# Altium schematic sheet OSCILLAR_HFB_V1p0_MOD.SchDoc
size A3; SheetNumber: 8; SheetTotal: 15; Title_: Modulator
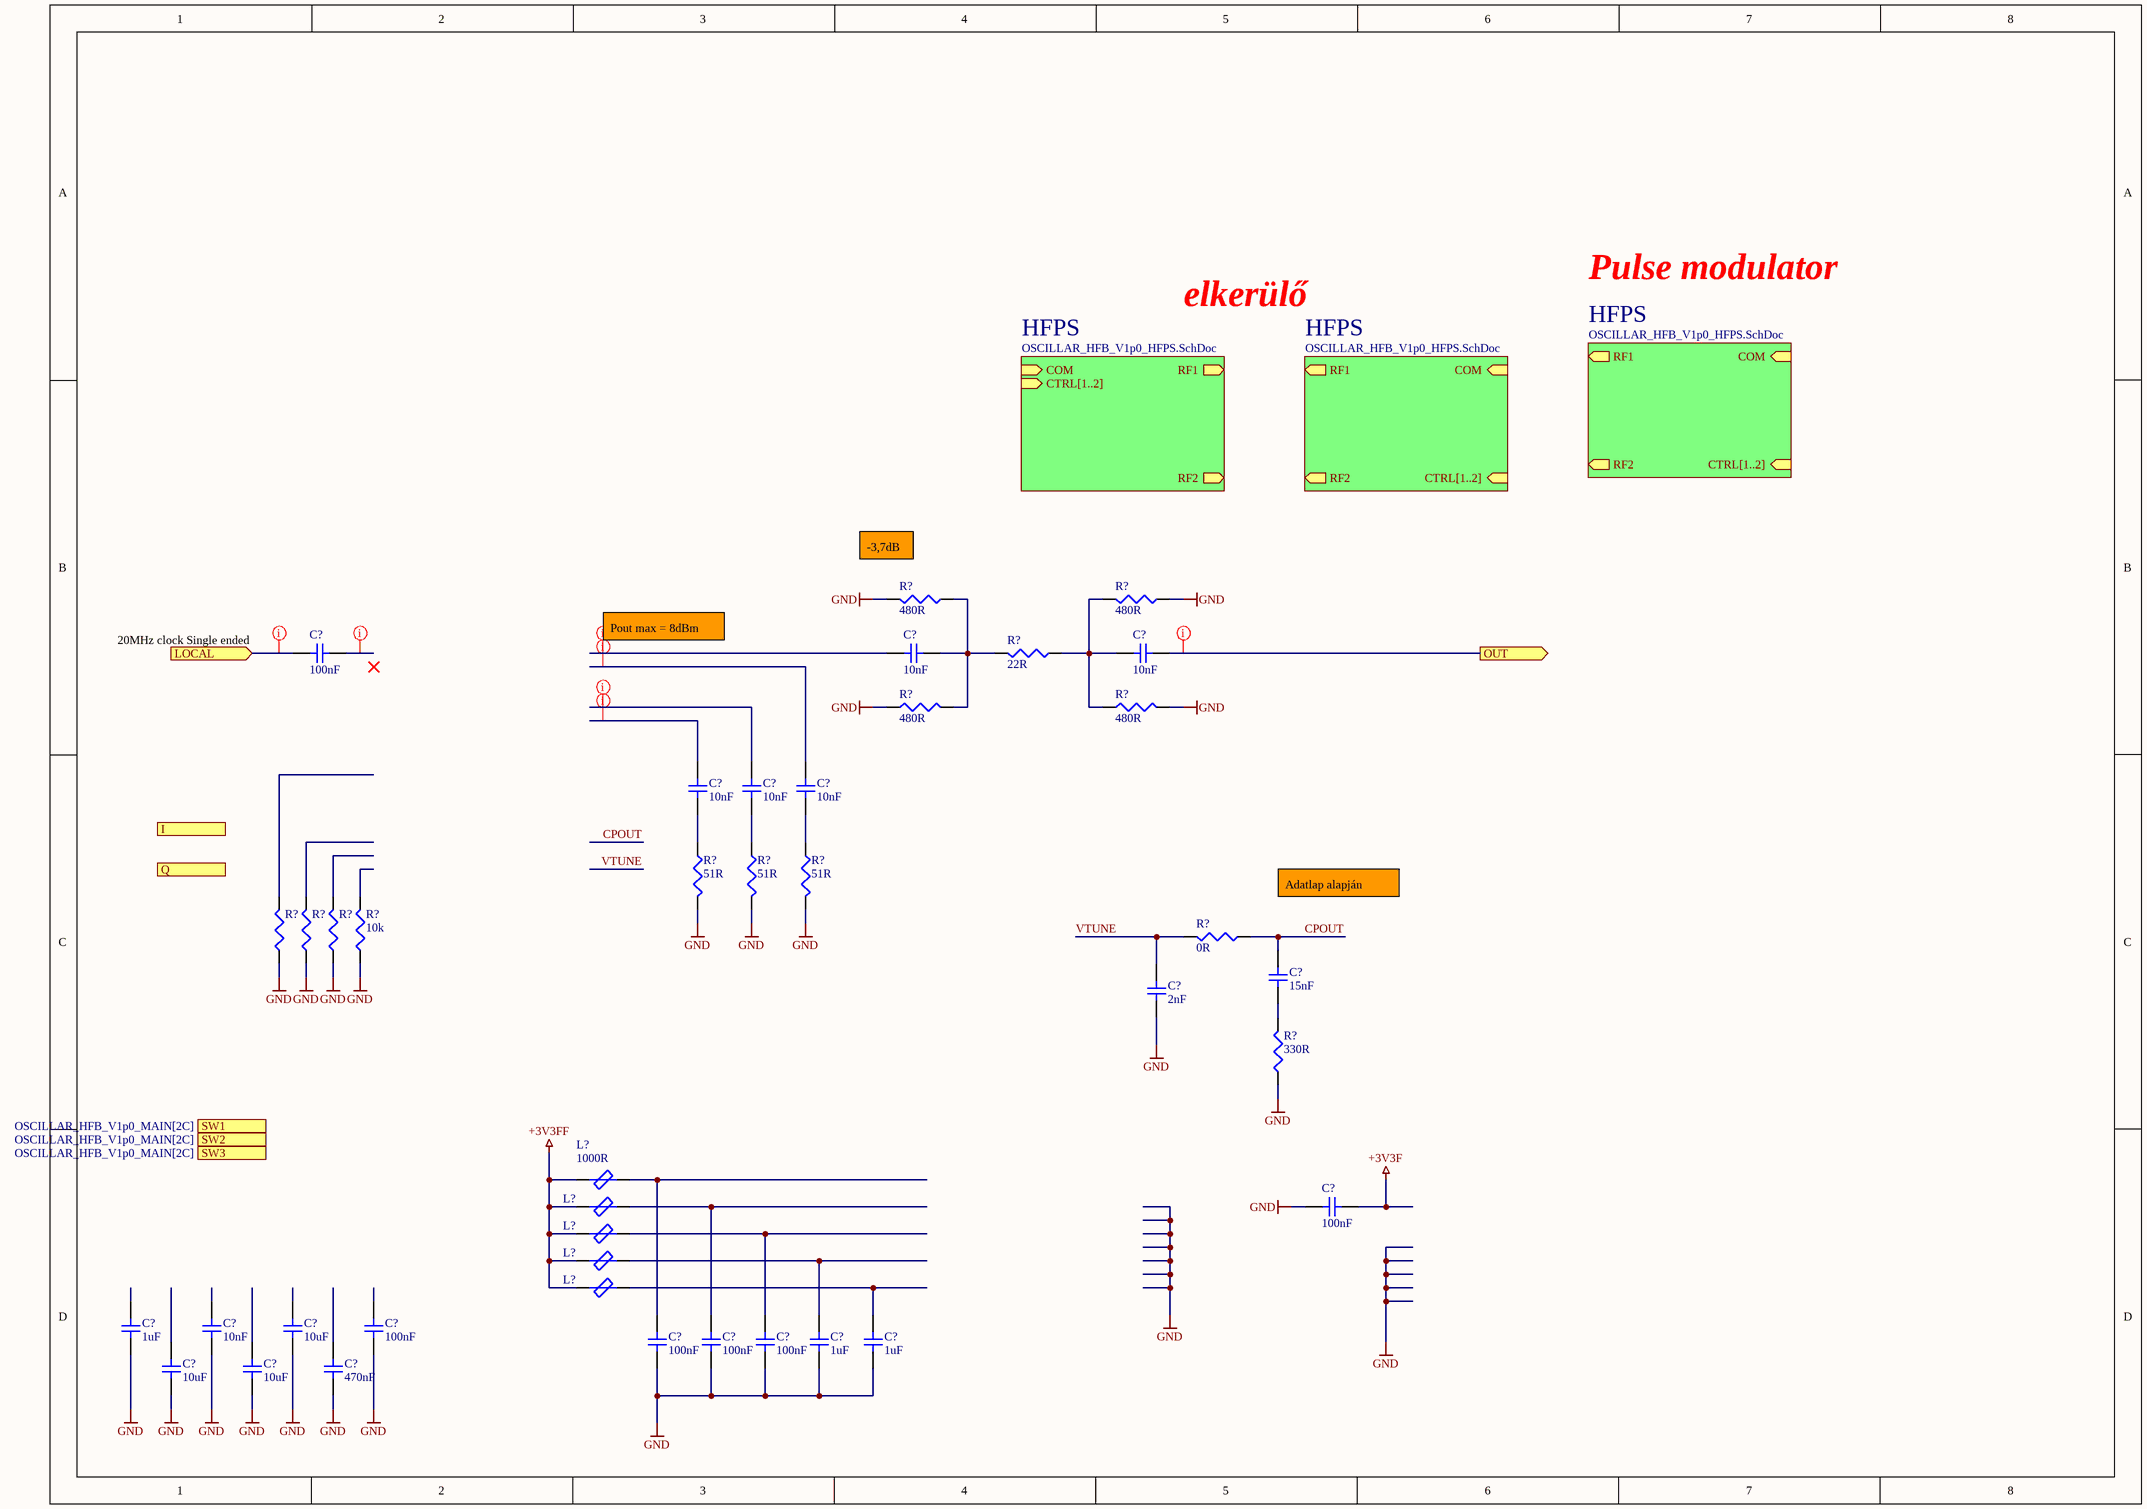
[diagram p0: OSCILLAR_HFB_V1p0_MOD.SchDoc]

## Parts
(Parts that share a designator on the sheet are numbered #1, #2 ... from top to bottom, then left to right.)
C?#1  100nF  [CAP_0603]
C?#2  10nF  [CAP_0603]
C?#3  10nF  [CAP_0603]
C?#4  10nF  [CAP_0603]
C?#5  10nF  [CAP_0603]
C?#6  10nF  [CAP_0603]
C?#7  15nF  [CAP_0603]
C?#8  2nF  [CAP_0603]
C?#9  100nF  [CAP_0603]
C?#10  1uF  [CAP_0603]
C?#11  10nF  [CAP_0603]
C?#12  10uF  [CAP_0603]
C?#13  100nF  [CAP_0603]
C?#14  100nF  [CAP_0603]
C?#15  100nF  [CAP_0603]
C?#16  100nF  [CAP_0603]
C?#17  1uF  [CAP_0603]
C?#18  1uF  [CAP_0603]
C?#19  10uF  [CAP_0603]
C?#20  10uF  [CAP_0603]
C?#21  470nF  [CAP_0603]
L?#1  1000R  [IND-0805-EMI]
L?#2  1000R  [IND-0805-EMI]  (value not drawn)
L?#3  1000R  [IND-0805-EMI]  (value not drawn)
L?#4  1000R  [IND-0805-EMI]  (value not drawn)
L?#5  1000R  [IND-0805-EMI]  (value not drawn)
R?#1  480R  [RES-0603]
R?#2  480R  [RES-0603]
R?#3  22R  [RES-0805]
R?#4  480R  [RES-0603]
R?#5  480R  [RES-0603]
R?#6  51R  [RES-0603]
R?#7  51R  [RES-0603]
R?#8  51R  [RES-0603]
R?#9  51R  [RES-0603]  (value not drawn)
R?#10  51R  [RES-0603]  (value not drawn)
R?#11  51R  [RES-0603]  (value not drawn)
R?#12  10k  [RES-0603]
R?#13  0R  [RES-0603]
R?#14  330R  [RES-0603]

## Sub-sheets
HFPS = OSCILLAR_HFB_V1p0_HFPS.SchDoc: COM (in), RF1 (out), CTRL[1..2] (in), RF2 (out)
HFPS = OSCILLAR_HFB_V1p0_HFPS.SchDoc: RF1 (out), CTRL[1..2] (in), COM (in), RF2 (out)
HFPS = OSCILLAR_HFB_V1p0_HFPS.SchDoc: RF1 (out), CTRL[1..2] (in), COM (in), RF2 (out)

## Ports
I (in, see OSCILLAR_HFB_V1p0_MAIN[2C]), LOCAL (in, see OSCILLAR_HFB_V1p0_MAIN[2C]), OUT (out, see OSCILLAR_HFB_V1p0_MAIN[3C]), Q (in, see OSCILLAR_HFB_V1p0_MAIN[2C]), SW1 (in, see OSCILLAR_HFB_V1p0_MAIN[2C]), SW2 (in, see OSCILLAR_HFB_V1p0_MAIN[2C]), SW3 (in, see OSCILLAR_HFB_V1p0_MAIN[2C])

## Nets
+3V3F: C?#9.2
+3V3FF: L?#1.1 L?#2.1 L?#3.1 L?#4.1 L?#5.1
GND: C?#8.2 C?#9.1 C?#10.2 C?#11.2 C?#12.2 C?#13.2 C?#14.1 C?#15.1 C?#16.1 C?#17.1 C?#18.1 C?#19.2 C?#20.2 C?#21.2 R?#1.2 R?#2.2 R?#4.1 R?#5.1 R?#6.2 R?#7.2 R?#8.2 R?#9.1 R?#10.1 R?#11.1 R?#12.1 R?#14.1
CPOUT: C?#7.2 R?#13.1
LOCAL: C?#1.2 ; port LOCAL
OUT: C?#3.2 ; port OUT
VTUNE: C?#8.1 R?#13.2
NetC?#2_1: C?#2.1 R?#1.1 R?#3.2 R?#4.2
NetC?#3_1: C?#3.1 R?#2.1 R?#3.1 R?#5.2
NetC?#4_2: C?#4.2 R?#6.1
NetC?#5_2: C?#5.2 R?#7.1
NetC?#6_2: C?#6.2 R?#8.1
NetC?#7_1: C?#7.1 R?#14.2
NetC?#14_2: C?#14.2 L?#1.2
NetC?#15_2: C?#15.2 L?#2.2
NetC?#16_2: C?#16.2 L?#3.2
NetC?#17_2: C?#17.2 L?#4.2
NetC?#18_2: C?#18.2 L?#5.2

Not connected (* = marked no-connect by the designer): C?#1 1; C?#2 2; C?#4 1; C?#5 1; C?#6 1; C?#10 1; C?#11 1; C?#12 1; C?#13 1; C?#19 1; C?#20 1; C?#21 1; R?#9 2; R?#10 2; R?#11 2; R?#12 2

## Layout directives
net class 50R: LOCAL, NetC?#1_1, NetC?#2_2, NetC?#4_1, NetC?#5_1, NetC?#6_1, OUT

## Notes on the sheet
- elkerülő
- Pulse modulator
- (near R?#1) -3,7dB
- (near C?#1) 20MHz clock Single ended
- Pout max = 8dBm
- Adatlap alapján
- Board:
- Author:
- Title:
- Project:
- SVN:
- Version:
- Sheet:
- of
- Contact:
- Modified:
- Size:
- A4

## Library data of the parts
C?#1-C?#21 = NP-CAPACITOR: MLCC capacitor; Type: CAP
L?#1-L?#5 = BLM21SP102SN1D: Chip Ferrite Bead, 1000R @100MHz, 1.6A; Part number: 81-BLM21SP102SN1D; Type: IND; Supplier: Mouser; ComponentLink1Description: Datasheet; ComponentLink1URL: ENFA0005-1915781.pdf; ComponentLink2Description: Order; ComponentLink2URL: https://hu.mouser.com/ProductDetail/Murata-Electronics/BLM21SP102SN1D?qs=17u8i%2FzlE88oj6hmj%252BXptA%3D%3D
R?#1-R?#14 = RESISTOR: Metal Film Resistor; Type: RES